# Altium schematic sheet Main.SchDoc
size A4; SheetNumber: 1; SheetTotal: 1
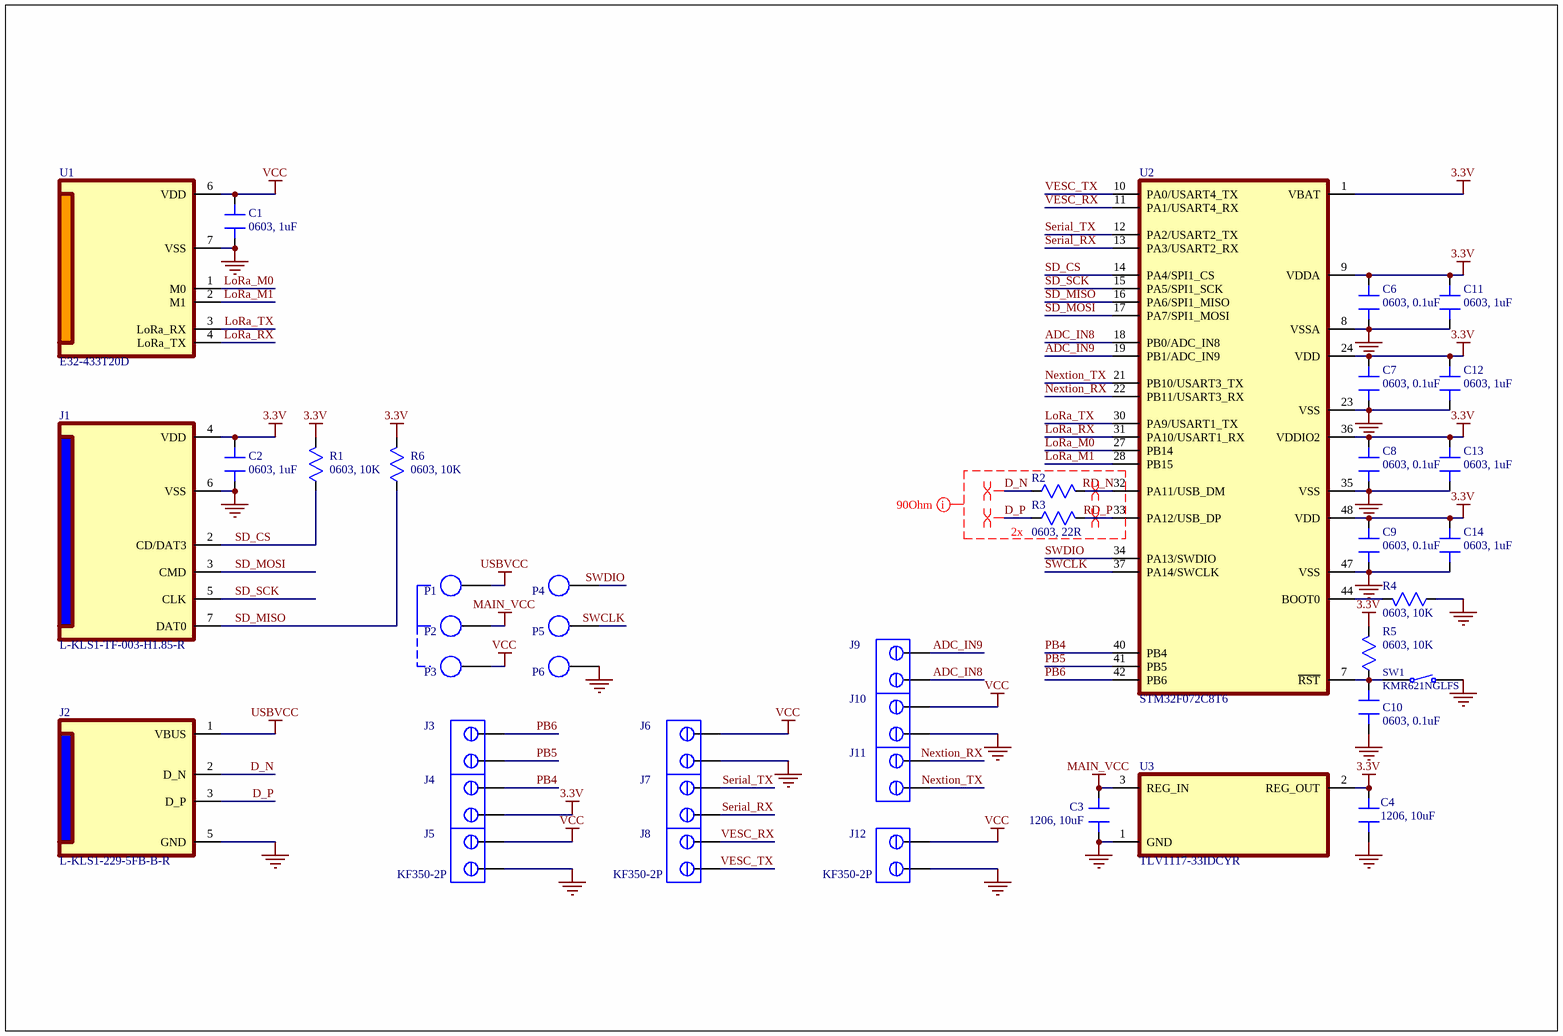
[diagram p0: Main.SchDoc]

## Parts
C1  0603, 1uF  [CAP 0603_1608]
C2  0603, 1uF  [CAP 0603_1608]
C3  1206, 10uF  [CAP 1206_3216]
C4  1206, 10uF  [CAP 1206_3216]
C6  0603, 0.1uF  [CAP 0603_1608]
C7  0603, 0.1uF  [CAP 0603_1608]
C8  0603, 0.1uF  [CAP 0603_1608]
C9  0603, 0.1uF  [CAP 0603_1608]
C10  0603, 0.1uF  [CAP 0603_1608]
C11  0603, 1uF  [CAP 0603_1608]
C12  0603, 1uF  [CAP 0603_1608]
C13  0603, 1uF  [CAP 0603_1608]
C14  0603, 1uF  [CAP 0603_1608]
J1  L-KLS1-TF-003-H1.85-R  [L-KLS1-TF-003-H1.85-R]
J2  L-KLS1-229-5FB-B-R  [L-KLS1-229-5FB-B-R]
J3  KF350-2P  [KF350-2P]  (value not drawn)
J4  KF350-2P  [KF350-2P]  (value not drawn)
J5  KF350-2P  [KF350-2P]
J6  KF350-2P  [KF350-2P]  (value not drawn)
J7  KF350-2P  [KF350-2P]  (value not drawn)
J8  KF350-2P  [KF350-2P]
J9  KF350-2P  [KF350-2P]  (value not drawn)
J10  KF350-2P  [KF350-2P]  (value not drawn)
J11  KF350-2P  [KF350-2P]  (value not drawn)
J12  KF350-2P  [KF350-2P]
P1  Pad  [PAD]  (value not drawn)
P2  Pad  [PAD]  (value not drawn)
P3  Pad  [PAD]  (value not drawn)
P4  Pad  [PAD]  (value not drawn)
P5  Pad  [PAD]  (value not drawn)
P6  Pad  [PAD]  (value not drawn)
R1  0603, 10K  [RES 0603_1608]
R2  0603, ?R/K  [RES 0603_1608]  (value not drawn)
R3  0603, 22R  [RES 0603_1608]
R4  0603, 10K  [RES 0603_1608]
R5  0603, 10K  [RES 0603_1608]
R6  0603, 10K  [RES 0603_1608]
SW1  KMR621NGLFS  [SW_KMR621NGLFS]
U1  E32-433T20D  [E32-433T20D]
U2  STM32F072C8T6  [STM32F072C8T6]
U3  TLV1117-33IDCYR  [SOT230P700X180-4N]

## Nets
3.3V: C2.2 C4.2 C6.2 C7.2 C8.2 C9.2 C11.2 C12.2 C13.2 C14.2 J1.4(VDD) J4.2 R1.1 R5.1 R6.1 U2.1(VBAT) U2.9(VDDA) U2.24(VDD) U2.36(VDDIO2) U2.48(VDD) U3.2(REG_OUT)
GND: C1.1 C2.1 C3.1 C4.1 C6.1 C7.1 C8.1 C9.1 C10.1 C11.1 C12.1 C13.1 C14.1 J1.6(VSS) J2.5(GND) J5.2 J6.2 J10.2 J12.2 P6.1 R4.2 SW1.1 U1.7(VSS) U2.8(VSSA) U2.23(VSS) U2.35(VSS) U2.47(VSS) U3.1(GND)
MAIN_VCC: C3.2 P2.1 U3.3(REG_IN)
USBVCC: J2.1(VBUS) P1.1
VCC: C1.2 J5.1 J6.1 J10.1 J12.1 P3.1 U1.6(VDD)
ADC_IN8: J9.2 U2.18(PB0/ADC_IN8)
ADC_IN9: J9.1 U2.19(PB1/ADC_IN9)
D_N: J2.2(D_N) R2.2
D_P: J2.3(D_P) R3.2
LoRa_M0: U1.1(M0) U2.27(PB14)
LoRa_M1: U1.2(M1) U2.28(PB15)
LoRa_RX: U1.4(LoRa_TX) U2.31(PA10/USART1_RX)
LoRa_TX: U1.3(LoRa_RX) U2.30(PA9/USART1_TX)
Nextion_RX: J11.1 U2.22(PB11/USART3_RX)
Nextion_TX: J11.2 U2.21(PB10/USART3_TX)
PB4: J4.1 U2.40(PB4)
PB5: J3.2 U2.41(PB5)
PB6: J3.1 U2.42(PB6)
RD_N: R2.1 U2.32(PA11/USB_DM)
RD_P: R3.1 U2.33(PA12/USB_DP)
SD_CS: J1.2(CD/DAT3) R1.2 U2.14(PA4/SPI1_CS)
SD_MISO: J1.7(DAT0) R6.2 U2.16(PA6/SPI1_MISO)
SD_MOSI: J1.3(CMD) U2.17(PA7/SPI1_MOSI)
SD_SCK: J1.5(CLK) U2.15(PA5/SPI1_SCK)
Serial_RX: J7.2 U2.13(PA3/USART2_RX)
Serial_TX: J7.1 U2.12(PA2/USART2_TX)
SWCLK: P5.1 U2.37(PA14/SWCLK)
SWDIO: P4.1 U2.34(PA13/SWDIO)
VESC_RX: J8.1 U2.11(PA1/USART4_RX)
VESC_TX: J8.2 U2.10(PA0/USART4_TX)
NetC10_2: C10.2 R5.2 SW1.2 U2.7(~{RST})
NetR4_1: R4.1 U2.44(BOOT0)

## Layout directives
differential pair: D_N, D_P, RD_N, RD_P
rule Differential Pairs Routing [Pref Gap = 5mil    Min Gap  = 5mil    Max Gap  = 5milPref Width = 7.241mil    Min Width  = 7.241mil    Max Width  = 7.241mil]: D_N, D_P, RD_N, RD_P

## Notes on the sheet
- (near R3) 2x

## Library data of the parts
C1 C2 C6-C14 = 0603 Kapasitör
C3 C4 = 1206 Kapasitör
R1-R6 = 0603 Direnç